# EAGLE design mm5823_2 (EAGLE 7.1.0)
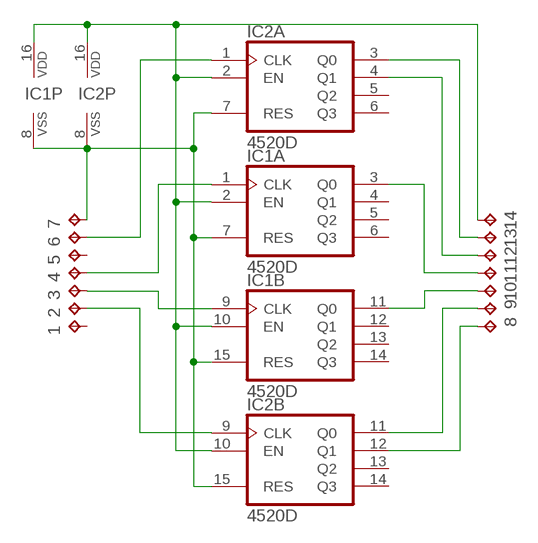
[diagram p0: schematic, sheet 1]

## Parts
1  TPB1,27  [B1,27]
2  TPB1,27  [B1,27]
3  TPB1,27  [B1,27]
4  TPB1,27  [B1,27]
5  TPB1,27  [B1,27]
6  TPB1,27  [B1,27]
7  TPB1,27  [B1,27]
8  TPB1,27  [B1,27]
9  TPB1,27  [B1,27]
10  TPB1,27  [B1,27]
11  TPB1,27  [B1,27]
12  TPB1,27  [B1,27]
13  TPB1,27  [B1,27]
14  TPB1,27  [B1,27]
IC1  4520D  [SO16]
IC2  4520D  [SO16]

## Nets
N$1: 13.TP IC2.3(A:Q0)
N$2: 12.TP IC2.4(A:Q1)
N$3: 8.TP IC2.12(B:Q1)
N$4: 9.TP IC2.11(B:Q0)
N$5: 6.TP IC2.1(A:CLK)
N$6: 2.TP IC2.9(B:CLK)
N$7: 11.TP IC1.3(A:Q0)
N$8: 10.TP IC1.11(B:Q0)
N$9: 4.TP IC1.1(A:CLK)
N$10: 3.TP IC1.9(B:CLK)
N$11: 7.TP IC1.7(A:RES) IC1.8(P:VSS) IC1.15(B:RES) IC2.7(A:RES) IC2.8(P:VSS) IC2.15(B:RES)
N$13: 14.TP IC1.2(A:EN) IC1.10(B:EN) IC1.16(P:VDD) IC2.2(A:EN) IC2.10(B:EN) IC2.16(P:VDD)
Unconnected: 1.TP 5.TP IC1.4(A:Q1) IC1.5(A:Q2) IC1.6(A:Q3) IC1.12(B:Q1) IC1.13(B:Q2) IC1.14(B:Q3) IC2.5(A:Q2) IC2.6(A:Q3) IC2.13(B:Q2) IC2.14(B:Q3)

## Library data of the parts
1-14 = testpad:TP: Test pad
IC1 IC2 = 45xx:4520: Dual binary up COUNTER

## Board
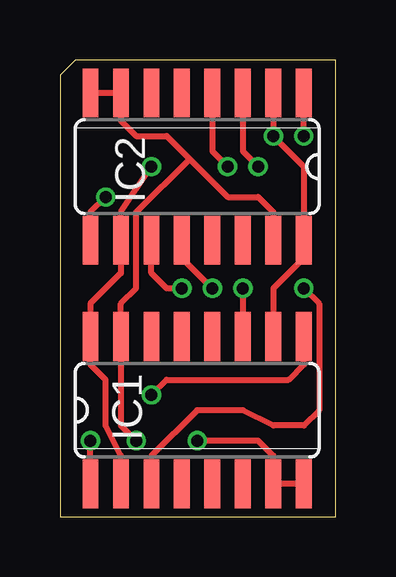
[diagram p1: board, top side]
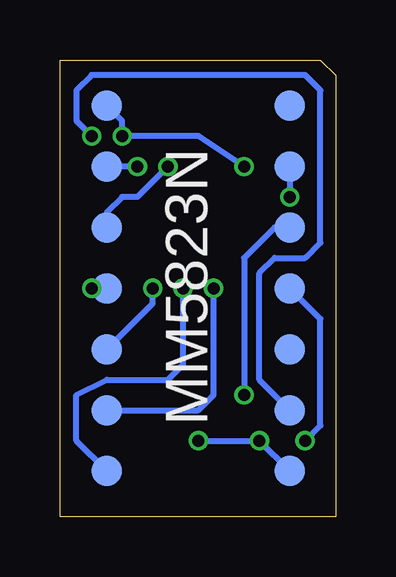
[diagram p2: board, bottom side, seen from below]

Size 11.48 x 19.05 mm. Coordinates in mm from the lower left corner, seen from the top.
Outline: 0,0 11.48,0 11.48,19.04 0.64,19.05 0.64,19.04 0,18.41 0,0
Copper layers (1*16): Top 0.035mm / dielectric 1.5mm / Bottom 0.035mm
Design rules "ITEADstudio_DRC": minimum track width 6mil, minimum drill 12mil, track to track 6mil, track to pad 6mil, pad to pad 6mil, via to via 6mil, smd to smd 0mil, copper to edge 10mil, drill to drill 10mil, minimum pad ring 10mil, minimum via ring 6mil, stop-mask expansion 2mil, vias tented up to drill 100mil, thermal gap 10mil

### Footprints (pad centres in the part's own frame; a part is rotated, then mirrored left to right if it is on the bottom)
B1,27 = smd 1.27 x 1.27: TP 0,0
SO16 = smd 0.66 x 2.032: 1 -4.445,-3.073; 2 -3.175,-3.073; 3 -1.905,-3.073; 4 -0.635,-3.073; 5 0.635,-3.073; 6 1.905,-3.073; 7 3.175,-3.073; 8 4.445,-3.073; 9 4.445,3.073; 10 3.175,3.073; 11 1.905,3.073; 12 0.635,3.073; 13 -0.635,3.073; 14 -1.905,3.073; 15 -3.175,3.073; 16 -4.445,3.073

### Placement (x,y rotation side)
1  1.91,17.14 0 bottom
2  1.91,14.61 0 bottom
3  1.91,12.06 0 bottom
4  1.91,9.53 0 bottom
5  1.91,6.99 0 bottom
6  1.91,4.45 0 bottom
7  1.91,1.91 0 bottom
8  9.53,1.91 0 bottom
9  9.53,4.45 0 bottom
10  9.53,6.99 0 bottom
11  9.53,9.53 0 bottom
12  9.53,12.06 0 bottom
13  9.53,14.61 0 bottom
14  9.53,17.14 0 bottom
IC1  5.71,4.45 0 top
IC2  5.71,14.61 180 top

### Tracks (layer width: path | path; a pad name or v marks a point on that pad's centre or on a via)
N$1  (via drill 0.5)
  Top 0.254: IC2.3 7.62,15.24 v8.26,14.61
  Bottom 0.254: v8.26,14.61 13.TP
N$2  (via drill 0.5)
  Top 0.254: IC2.4 6.35,15.24 v6.99,14.61
  Bottom 0.254: v6.99,14.61 8.26,13.34 8.89,13.34 9.53,12.7 12.TP
N$3  (via drill 0.5)
  Top 0.254: v6.35,9.53 5.08,10.79 IC2.12
  Bottom 0.254: 8.TP 10.79,3.17 10.79,5.08 9.53,5.71 6.99,5.71 6.35,6.35 v6.35,9.53
N$4  (via drill 0.5)
  Top 0.254: v5.08,9.53 4.45,9.53 3.81,10.16 IC2.11
  Bottom 0.254: 9.TP 5.71,4.45 5.08,5.08 v5.08,9.53
N$5  (via drill 0.5)
  Top 0.254: v10.16,15.88 IC2.1
  Bottom 0.254: 6.TP 3.17,5.71 3.17,10.16 2.54,10.79 1.27,10.79 0.64,11.43 0.64,17.78 1.27,18.41 10.16,18.41 10.79,17.78 10.79,16.51 v10.16,15.88
N$6  (via drill 0.5)
  Top 0.254: IC2.9 1.27,12.7 v1.91,13.34
  Bottom 0.254: 2.TP v1.91,13.34
N$7  (via drill 0.5)
  Top 0.254: v10.16,9.53 10.79,8.89 10.79,4.45 10.16,3.81 8.89,3.81 7.62,4.45 5.71,4.45 3.81,2.54 IC1.3
  Bottom 0.254: 11.TP v10.16,9.53
N$8  (via drill 0.5)
  Top 0.254: v7.62,9.53 IC1.11
  Bottom 0.254: 10.TP 7.62,8.89 v7.62,9.53
N$9  (via drill 0.5)
  Top 0.254: IC1.1 v1.27,3.17
  Bottom 0.254: v1.27,3.17 0.64,3.81 0.64,8.26 4.TP
N$10  (via drill 0.5)
  Top 0.254: v3.81,5.08 4.45,5.71 9.53,5.71 10.16,6.35 IC1.9
  Bottom 0.254: 3.TP 2.54,12.06 3.81,10.79 v3.81,5.08
N$11  (via drill 0.5)
  Top 0.254: IC1.8 IC1.7 8.89,2.54 8.26,3.17 v5.71,3.17 | IC2.8 IC2.7 2.54,16.51 3.17,15.88 4.45,15.88 5.4,14.92 | v3.17,3.17 2.54,3.81 IC1.15 2.54,8.89 3.17,9.53 3.17,12.7 5.4,14.92 | 5.4,14.92 6.99,13.34 8.26,13.34 8.89,12.7 IC2.15
  Bottom 0.254: 7.TP v3.17,3.17 v5.71,3.17
N$13  (via drill 0.5)
  Top 0.254: IC2.2 v8.89,15.88 10.16,14.61 IC2.16 10.16,10.79 8.89,9.53 IC1.10 | IC1.2 2.54,2.54 1.91,3.81 1.91,5.71 1.27,6.35 IC1.16 1.27,8.89 2.54,10.16 IC2.10 2.54,12.7 v3.81,14.61
  Bottom 0.254: 14.TP 8.89,16.51 v8.89,15.88 5.71,15.88 v3.81,14.61

### Text on the board
bNames: MM5823N